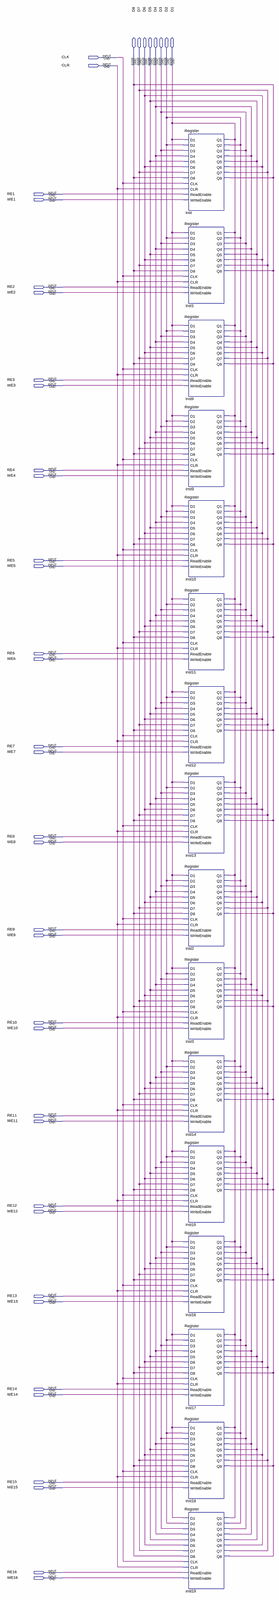
[diagram p0: schematic sheet, whole]
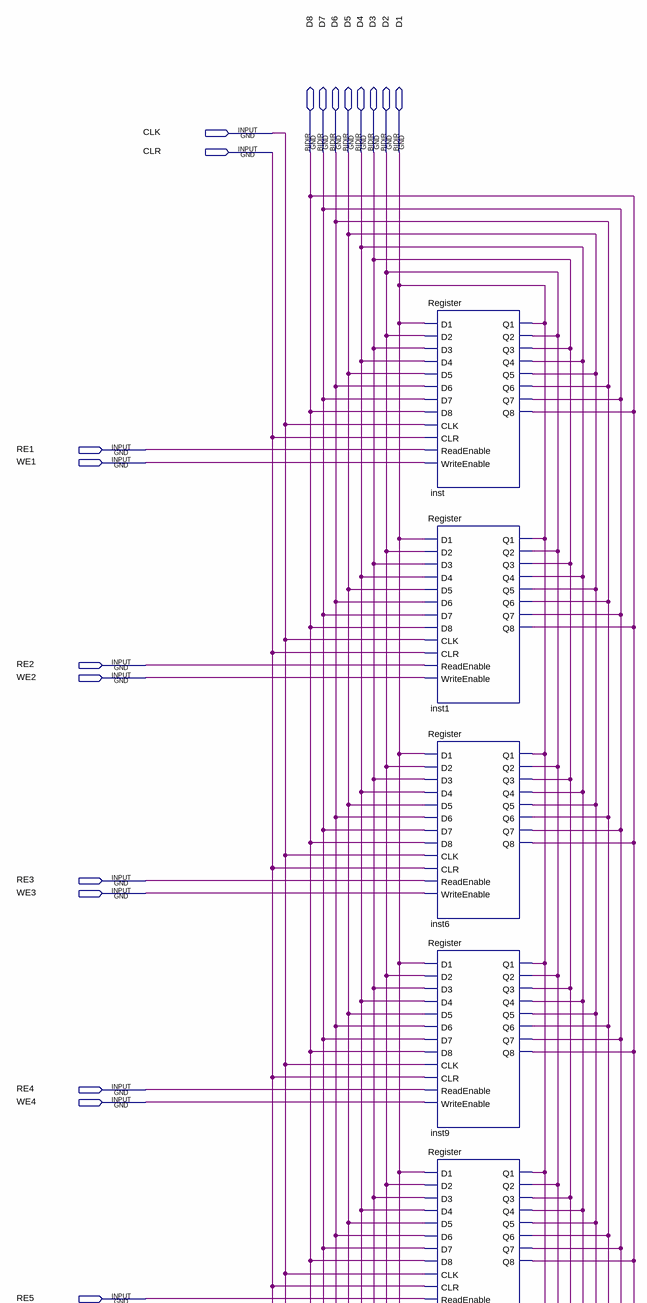
[diagram p1: schematic sheet, upper part]
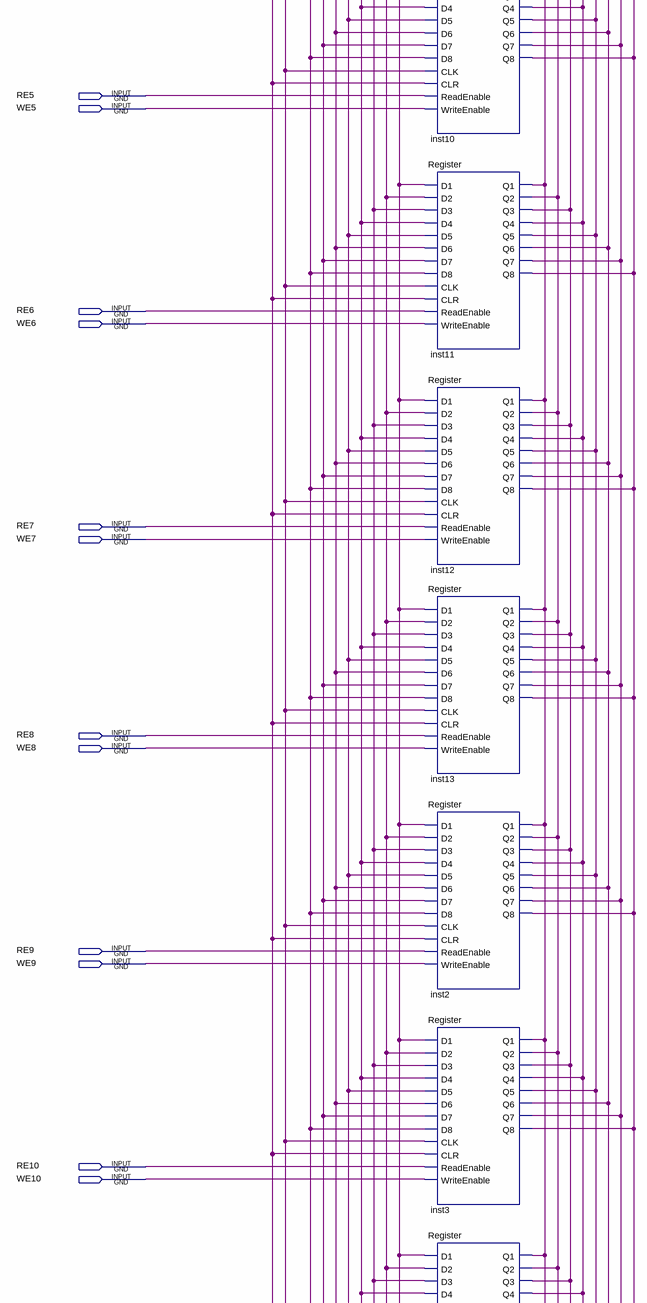
[diagram p2: schematic sheet, middle part]
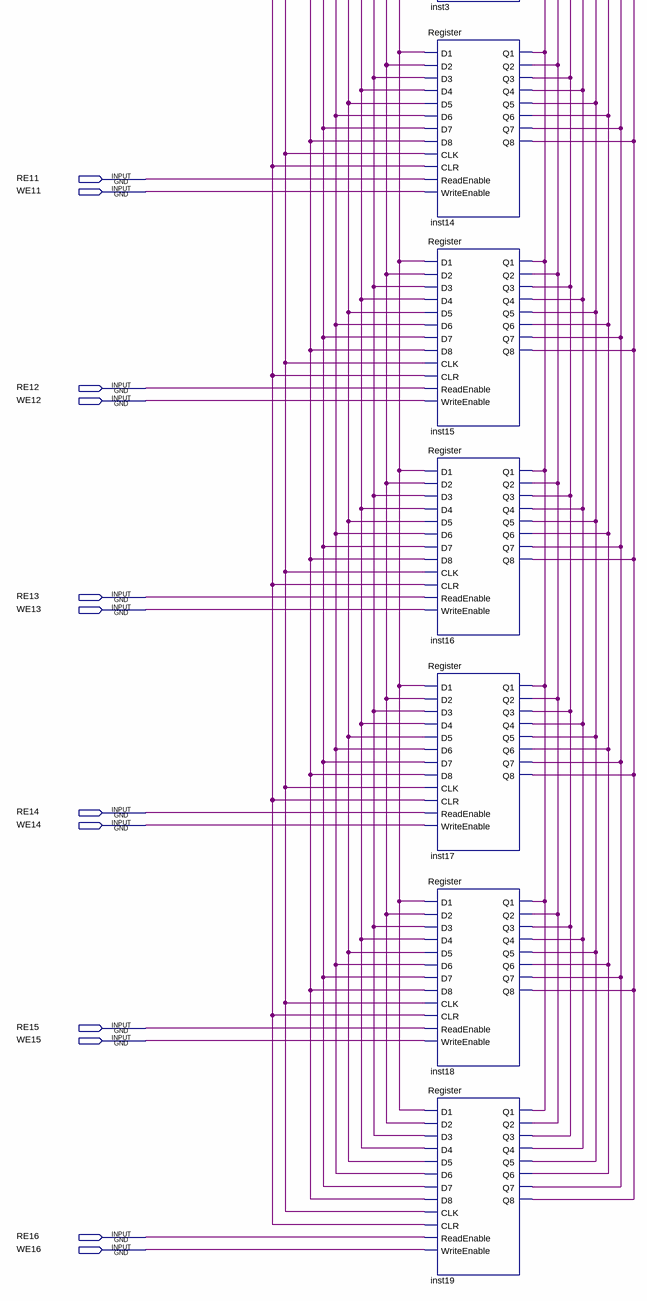
[diagram p3: schematic sheet, lower part]
// Quartus schematic RAMCells.bdf as structural Verilog: 16 symbols, 42 pins
module RAMCells (
  input  CLK,
  input  CLR,
  input  RE1,
  input  WE1,
  input  RE2,
  input  WE2,
  input  RE3,
  input  WE3,
  input  RE4,
  input  WE4,
  input  RE5,
  input  WE5,
  input  RE6,
  input  WE6,
  input  RE7,
  input  WE7,
  input  RE8,
  input  WE8,
  input  RE9,
  input  WE9,
  input  RE10,
  input  WE10,
  input  RE11,
  input  WE11,
  input  RE12,
  input  WE12,
  input  RE13,
  input  WE13,
  input  RE14,
  input  WE14,
  input  RE15,
  input  WE15,
  input  RE16,
  input  WE16,
  inout  D8,
  inout  D7,
  inout  D6,
  inout  D5,
  inout  D4,
  inout  D3,
  inout  D2,
  inout  D1
);

  Register inst (
    .D1(D1), .D2(D2), .D3(D3), .D4(D4), .D5(D5), .D6(D6), .D7(D7), .D8(D8), .CLK(CLK), .CLR(CLR),
    .ReadEnable(RE1), .WriteEnable(WE1), .Q1(D1), .Q2(D2), .Q3(D3), .Q4(D4), .Q5(D5), .Q6(D6), .Q7(D7),
    .Q8(D8));
  Register inst1 (
    .D1(D1), .D2(D2), .D3(D3), .D4(D4), .D5(D5), .D6(D6), .D7(D7), .D8(D8), .CLK(CLK), .CLR(CLR),
    .ReadEnable(RE2), .WriteEnable(WE2), .Q1(D1), .Q2(D2), .Q3(D3), .Q4(D4), .Q5(D5), .Q6(D6), .Q7(D7),
    .Q8(D8));
  Register inst6 (
    .D1(D1), .D2(D2), .D3(D3), .D4(D4), .D5(D5), .D6(D6), .D7(D7), .D8(D8), .CLK(CLK), .CLR(CLR),
    .ReadEnable(RE3), .WriteEnable(WE3), .Q1(D1), .Q2(D2), .Q3(D3), .Q4(D4), .Q5(D5), .Q6(D6), .Q7(D7),
    .Q8(D8));
  Register inst9 (
    .D1(D1), .D2(D2), .D3(D3), .D4(D4), .D5(D5), .D6(D6), .D7(D7), .D8(D8), .CLK(CLK), .CLR(CLR),
    .ReadEnable(RE4), .WriteEnable(WE4), .Q1(D1), .Q2(D2), .Q3(D3), .Q4(D4), .Q5(D5), .Q6(D6), .Q7(D7),
    .Q8(D8));
  Register inst10 (
    .D1(D1), .D2(D2), .D3(D3), .D4(D4), .D5(D5), .D6(D6), .D7(D7), .D8(D8), .CLK(CLK), .CLR(CLR),
    .ReadEnable(RE5), .WriteEnable(WE5), .Q1(D1), .Q2(D2), .Q3(D3), .Q4(D4), .Q5(D5), .Q6(D6), .Q7(D7),
    .Q8(D8));
  Register inst11 (
    .D1(D1), .D2(D2), .D3(D3), .D4(D4), .D5(D5), .D6(D6), .D7(D7), .D8(D8), .CLK(CLK), .CLR(CLR),
    .ReadEnable(RE6), .WriteEnable(WE6), .Q1(D1), .Q2(D2), .Q3(D3), .Q4(D4), .Q5(D5), .Q6(D6), .Q7(D7),
    .Q8(D8));
  Register inst12 (
    .D1(D1), .D2(D2), .D3(D3), .D4(D4), .D5(D5), .D6(D6), .D7(D7), .D8(D8), .CLK(CLK), .CLR(CLR),
    .ReadEnable(RE7), .WriteEnable(WE7), .Q1(D1), .Q2(D2), .Q3(D3), .Q4(D4), .Q5(D5), .Q6(D6), .Q7(D7),
    .Q8(D8));
  Register inst13 (
    .D1(D1), .D2(D2), .D3(D3), .D4(D4), .D5(D5), .D6(D6), .D7(D7), .D8(D8), .CLK(CLK), .CLR(CLR),
    .ReadEnable(RE8), .WriteEnable(WE8), .Q1(D1), .Q2(D2), .Q3(D3), .Q4(D4), .Q5(D5), .Q6(D6), .Q7(D7),
    .Q8(D8));
  Register inst2 (
    .D1(D1), .D2(D2), .D3(D3), .D4(D4), .D5(D5), .D6(D6), .D7(D7), .D8(D8), .CLK(CLK), .CLR(CLR),
    .ReadEnable(RE9), .WriteEnable(WE9), .Q1(D1), .Q2(D2), .Q3(D3), .Q4(D4), .Q5(D5), .Q6(D6), .Q7(D7),
    .Q8(D8));
  Register inst3 (
    .D1(D1), .D2(D2), .D3(D3), .D4(D4), .D5(D5), .D6(D6), .D7(D7), .D8(D8), .CLK(CLK), .CLR(CLR),
    .ReadEnable(RE10), .WriteEnable(WE10), .Q1(D1), .Q2(D2), .Q3(D3), .Q4(D4), .Q5(D5), .Q6(D6), .Q7(D7),
    .Q8(D8));
  Register inst14 (
    .D1(D1), .D2(D2), .D3(D3), .D4(D4), .D5(D5), .D6(D6), .D7(D7), .D8(D8), .CLK(CLK), .CLR(CLR),
    .ReadEnable(RE11), .WriteEnable(WE11), .Q1(D1), .Q2(D2), .Q3(D3), .Q4(D4), .Q5(D5), .Q6(D6), .Q7(D7),
    .Q8(D8));
  Register inst15 (
    .D1(D1), .D2(D2), .D3(D3), .D4(D4), .D5(D5), .D6(D6), .D7(D7), .D8(D8), .CLK(CLK), .CLR(CLR),
    .ReadEnable(RE12), .WriteEnable(WE12), .Q1(D1), .Q2(D2), .Q3(D3), .Q4(D4), .Q5(D5), .Q6(D6), .Q7(D7),
    .Q8(D8));
  Register inst16 (
    .D1(D1), .D2(D2), .D3(D3), .D4(D4), .D5(D5), .D6(D6), .D7(D7), .D8(D8), .CLK(CLK), .CLR(CLR),
    .ReadEnable(RE13), .WriteEnable(WE13), .Q1(D1), .Q2(D2), .Q3(D3), .Q4(D4), .Q5(D5), .Q6(D6), .Q7(D7),
    .Q8(D8));
  Register inst17 (
    .D1(D1), .D2(D2), .D3(D3), .D4(D4), .D5(D5), .D6(D6), .D7(D7), .D8(D8), .CLK(CLK), .CLR(CLR),
    .ReadEnable(RE14), .WriteEnable(WE14), .Q1(D1), .Q2(D2), .Q3(D3), .Q4(D4), .Q5(D5), .Q6(D6), .Q7(D7),
    .Q8(D8));
  Register inst18 (
    .D1(D1), .D2(D2), .D3(D3), .D4(D4), .D5(D5), .D6(D6), .D7(D7), .D8(D8), .CLK(CLK), .CLR(CLR),
    .ReadEnable(RE15), .WriteEnable(WE15), .Q1(D1), .Q2(D2), .Q3(D3), .Q4(D4), .Q5(D5), .Q6(D6), .Q7(D7),
    .Q8(D8));
  Register inst19 (
    .D1(D1), .D2(D2), .D3(D3), .D4(D4), .D5(D5), .D6(D6), .D7(D7), .D8(D8), .CLK(CLK), .CLR(CLR),
    .ReadEnable(RE16), .WriteEnable(WE16), .Q1(D1), .Q2(D2), .Q3(D3), .Q4(D4), .Q5(D5), .Q6(D6), .Q7(D7),
    .Q8(D8));
endmodule
